# Altium project zb_relay.PrjPcb
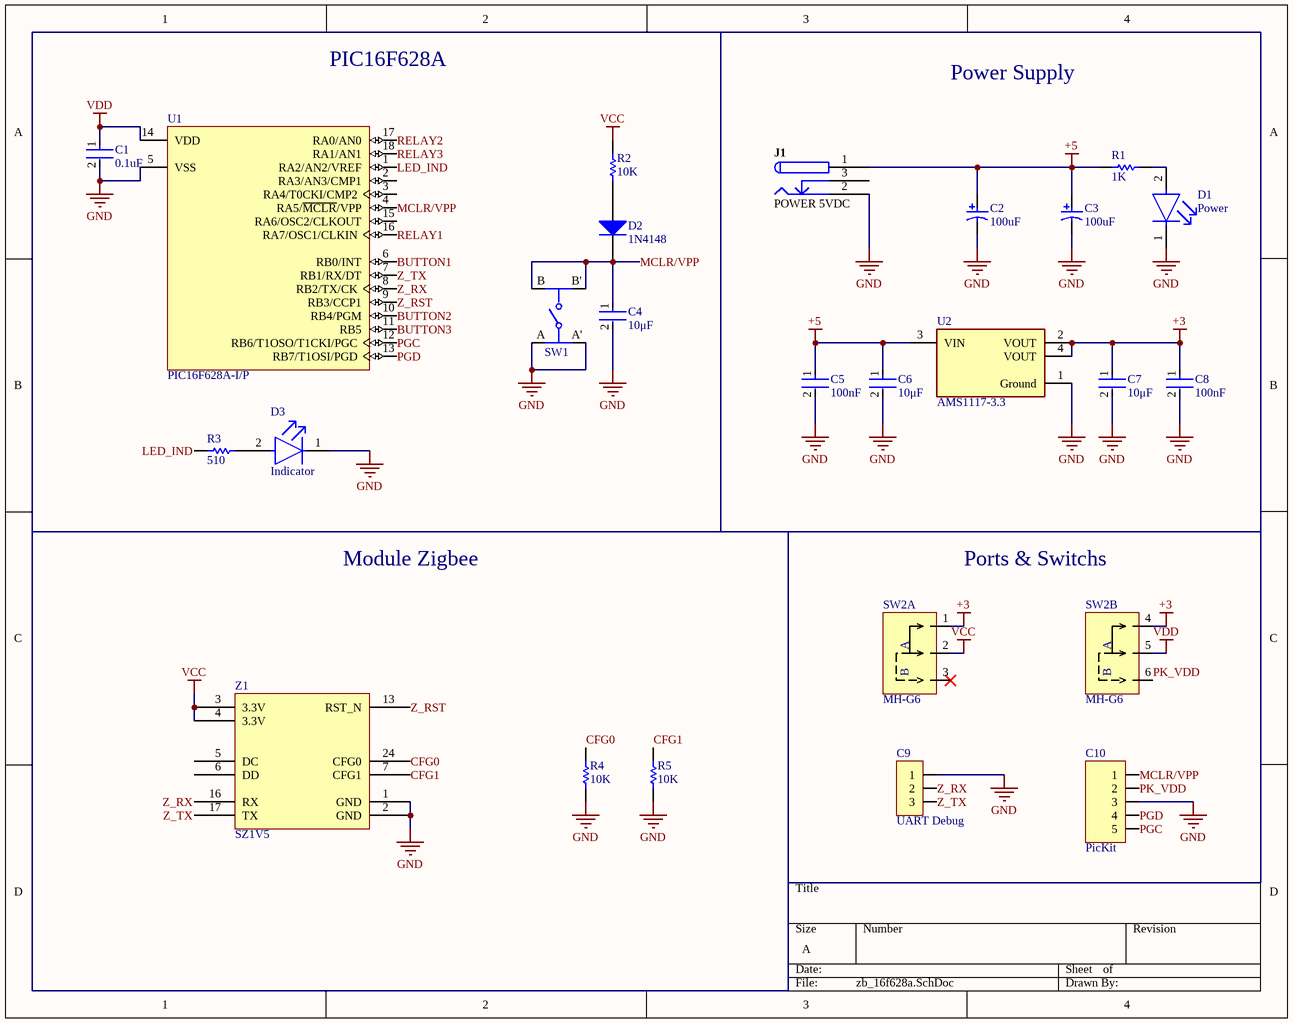
[diagram p0: zb_16f628a.SchDoc]
2 sheets, 57 parts. Net scope: global (net labels, ports and power ports of the same name join across sheets).
Board file: zb_relay.PcbDoc
Sheets:
  zb_16f628a.SchDoc
  relay_button.SchDoc

## Sheet zb_16f628a.SchDoc
size A; SheetNumber: 1; SheetTotal: 2

### Parts
C1  0.1uF  [FP-0603-L_1_6_0_15-W_0_81-MFG]
C2  100uF  [PNSC-FK-V-D8_V]
C3  100uF  [PNSC-FK-V-D8_V]
C4  10μF  [FP-0603-L_1_6_0_15-W_0_81-IPC_A]
C5  100nF  [FP-0603-L_1_6_0_15-W_0_81-IPC_A]
C6  10μF  [FP-0603-L_1_6_0_15-W_0_81-IPC_A]
C7  10μF  [FP-0603-L_1_6_0_15-W_0_81-IPC_A]
C8  100nF  [FP-0603-L_1_6_0_15-W_0_81-IPC_A]
C9  UART Debug  [JP3-D1C]
C10  PicKit  [JP5-D1C]
D1  Power  [FP-HLMP-4700-MFG]
D2  1N4148  [NXP-SOD27-2_V]
D3  Indicator  [FP-HLMP-4700-MFG]
J1  POWER 5VDC  [KYCN-KLDX-0202-B_V]
R1  1K  [RESC1609X55X30ML15T15]
R2  10K  [RESC1609X55X30ML15T15]
R3  510  [RESC1609X55X30ML15T15]
R4  10K  [RESC1609X55X30ML15T15]
R5  10K  [RESC1609X55X30ML15T15]
SW1  RESET  [FP-EVQ-PAG05R-MFG]  (value not drawn)
SW2  MH-G6  [MH-G6]  (parts A,B of 2)
U1  PIC16F628A-I/P  [PDIP300-P18]
U2  AMS1117-3.3  [FP-AMS1117-IPC_A]
Z1  SZ1V5  [SZ1V5 PINOUT MODULE]

### Nets
+3: C7.1 C8.1 SW2.1(A) SW2.4(A) U2.2(VOUT) U2.4(VOUT)
+5: C2.1 C3.1 C5.1 C6.1 J1.1 R1.2 U2.3(VIN)
GND: C1.2 C2.2 C3.2 C4.2 C5.2 C6.2 C7.2 C8.2 C9.1 C10.3 D1.1(C) D3.1(C) J1.2 R4.1 R5.1 SW1.A SW1.A' U1.5(VSS) U2.1(Ground) Z1.1(GND) Z1.2(GND)
VCC: R2.2 SW2.2(COM) Z1.3(3.3V) Z1.4(3.3V)
VDD: C1.1 SW2.5(COM) U1.14(VDD)
BUTTON1: U1.6(RB0/INT)
BUTTON2: U1.10(RB4/PGM)
BUTTON3: U1.11(RB5)
CFG0: R4.2 Z1.24(CFG0)
CFG1: R5.2 Z1.7(CFG1)
LED_IND: R3.2 U1.1(RA2/AN2/VREF)
MCLR/VPP: C4.1 C10.1 D2.2(K) SW1.B SW1.B' U1.4(RA5/~{MCLR}/VPP)
PGC: C10.5 U1.12(RB6/T1OSO/T1CKI/PGC)
PGD: C10.4 U1.13(RB7/T1OSI/PGD)
PK_VDD: C10.2 SW2.6(B)
RELAY1: U1.16(RA7/OSC1/CLKIN)
RELAY2: U1.17(RA0/AN0)
RELAY3: U1.18(RA1/AN1)
Z_RST: U1.9(RB3/CCP1) Z1.13(RST_N)
Z_RX: C9.2 U1.8(RB2/TX/CK) Z1.16(RX)
Z_TX: C9.3 U1.7(RB1/RX/DT) Z1.17(TX)
NetD1_2: D1.2(A) R1.1
NetD2_1: D2.1(A) R2.1
NetD3_2: D3.2(A) R3.1

Not connected (* = marked no-connect by the designer): J1 3; SW2 3(B)*; U1 2(RA3/AN3/CMP1) 3(RA4/T0CKI/CMP2) 15(RA6/OSC2/CLKOUT); Z1 5(DC) 6(DD)

### Notes on the sheet
- PIC16F628A
- Power Supply
- Module Zigbee
- Ports & Switchs

### Library data of the parts
C1 C4-C8 = CMP-1035-02592-4: General Purpose Ceramic Capacitor, 0603, 100nF, 10%, X7R, 15%, 50V; Dissipation Factor: 2.5%; Radiation Hardening: No; Termination: SMD/SMT; Tolerance: 10%; Lead Free: Lead Free; Width: 0.81mm; Max Operating Temperature: 125°C; Thickness: 0.035inch; Voltage Rating: 50V; Height: 0.9mm; Case/Package: 0603; Depth: 0.81mm; Number of Pins: 2; Capacitance: 100nF; REACH SVHC: No SVHC; Case Code (Imperial): 0603; Voltage: 50V; Voltage Rating (DC): 50V; Mount: Surface Mount; Length: 1.6mm; Min Operating Temperature: -55°C; Packaging: Tape and Reel; Case Code (Metric): 1608; Dielectric Material: Ceramic; Package Quantity: 1; Dielectric: X7R; Contact Plating: Tin
C2 C3 = CMP-2000-06206-1: Aluminum Electrolytic Capacitor, 100 uF, +/- 20%, 25 V, 2-Pin SMD (Size Code D8), -55 to 105 degC, RoHS, Tape and Reel; Manufacturer: Panasonic; Type: Can; Lifetime@Temperature: 2000Hrs@105°C; Capacitance: 100µF; Rated Voltage: 25V; Ripple Current: 280mA; Impedance: 0.34O; Case Size/Dimension: Ø6.3x7.7mm; Operating Temp-Max: 105°C; Series: FK; Package URL: http://industrial.panasonic.com/cdbs/www-data/pdf/RDE0000/DME0000COL48.pdf; Mounting Technology: SurfaceMount; Package Description: 2-Pin Electrolytic Aluminum Capacitor, Body 6.6 x 6.6 mm; Datasheet Version: 03/2016; Datasheet URL: http://industrial.panasonic.com/cdbs/www-data/pdf/RDE0000/ABA0000C1181.pdf; Manufacturer URL: http://www.panasonic.com/; Package Reference: FK-V-D8; Operating Temp Range: -55to+105°C
C9 = JP3: WR-PHD 2.54 mm Angled Socket Header; Manufacturer: W¨¹rth Elektronik eiSos GmbH; partNo: 613003143121; ComponentLink1 Description: Manufacturer; ComponentLink2 Description: Datasheet; NoPins: 03; Created Date: 29 March 2013; ComponentLink1URL: http://www.we-online.com; ComponentLink2URL: http://katalog.we-online.de/em/datasheet/6130xx143121.pdf; Created by: Karrer Zheng
C10 = JP5: WR-PHD 2.54 mm Angled Socket Header; Manufacturer: W¨¹rth Elektronik eiSos GmbH; partNo: 613005143121; ComponentLink1 Description: Manufacturer; ComponentLink2 Description: Datasheet; NoPins: 05; Created Date: 29 March 2013; ComponentLink1URL: http://www.we-online.com; ComponentLink2URL: http://katalog.we-online.de/em/datasheet/6130xx143121.pdf; Created by: Karrer Zheng
D1 D3 = CMP-18399-000008-1: LED RED DIFFUSED T-1 3/4 T/H; Manufacturer: Broadcom; Luminous Intensity: 2.3mcd; Peak Emmision Wavelength: 635nm; Forward Voltage: 1.7V; Viewing Angle: 50°; Led Orientation: Straight; Reverse Voltage: 5V; Forward Current: 2mA; Power Dissipation: 14mW; Wavelength: 626nm; Digikey Description: LED RED DIFFUSED T-1 3/4 T/H; Device Class L3: unset; Temperature Range Low: -40°C; Temperature Range High: +100°C; RoHS: TRUE; Package: HLMP-4700; Octopart: https://octopart.com/hlmp-4700-broadcom-71130526; Automotive: No; ComponentLink2URL: https://docs.broadcom.com/docs/AV02-1557EN; Colour: Red; Temperature: -40°C to +100°C; Lead Free: Yes; Category: Diode; ComponentLink2Description: Datasheet; Manufacturer Part Number: HLMP-4700; Device Class L1: Optoelectronics; Device Class L2: LEDs; Mouser Description: LED; Red; 2.3mcd; 0.24In.Dia.; T-1-3/4; 500mA; 1.7V; 635nm; 50deg; 5V; 24mW; -55degC;
D2 = CMP-0648-00002-1: High-speed Diode, 100 V, 450 mA, 2-Pin SOD27, RoHS; Manufacturer: NXP Semiconductors; Configuration: Single; IR (VR: 20 V)=25 nA; IFRM: 450 mA; IFSM: 4 A Max.; Trr: 4 ns Max.; Cd: 4 pF Max.; VR: 100 V Max.; VF (IF: 10 mA)=1 V; IF: 200 mA Max.; ComponentLink1Description: Manufacturer URL; RoHS: TRUE; ComponentLink1URL: http://www.nxp.com/; ComponentLink3Description: Package Specification; DatasheetVersion: Aug-04; ComponentLink2Description: Datasheet; PackageVersion: Aug-04; PackageReference: SOD27; ComponentLink3URL: http://www.nxp.com/documents/data_sheet/1N4148_1N4448.pdf; Mounting Technology: Through Hole; ComponentLink2URL: http://www.nxp.com/documents/data_sheet/1N4148_1N4448.pdf; PartNumber: 1N4148; PackageDescription: 2-Pin Hermetically Sealed Glass Package, Axial Leaded, Dia 1.85 mm, Body Length 4.25 mm, Lead Spread 25.4 mm
J1 = CMP-0256-00001-1: 3 Conductor Power Jack, 2 break 2 aux contacts; PartNumber: KLDX-0202-B; ComponentLink2URL: http://anacapa.kycon.com/Catalog_PDF/KLDX_0202.pdf; PackageReference: KLDX-0202-B; Contact Finish: Brass; ComponentLink2Description: Datasheet; Mounting Technology: Through Hole; PackageDescription: Jack, 9 x 14.5 mm Body, 2.5 mm Center Pin Diameter; ComponentLink1Description: Manufacturer URL; ComponentLink1URL: http://kycon.com/
R1-R5 = CMP-1012-00623-3: Chip Resistor, 10 KOhm, +/- 1%, 0.1 W, -55 to 155 degC, 0603 (1608 Metric), RoHS, Tape and Reel; Manufacturer: Panasonic; Voltage Rating: 75V; Case\/Package: 0603; Power Rating: 100mW; Resistance: 10KOhm; Temperature Coefficient: 100ppm\/degreesC; Number of Pins: 2; Package Reference: 603; Depth: 0.8mm; Mount: SurfaceMount; Package Description: 2-Pin Surface Mount Device, Body 1.6 x 0.85 mm; Datasheet Version: 02/2017; Length: 1.6mm; Lead Free: LeadFree; Height: 0.45mm; Number of Terminations: 2; Max Power Dissipation: 100mW; Min Operating Temperature: -55degC; Datasheet URL: https://industrial.panasonic.com/cdbs/www-data/pdf/RDA0000/AOA0000C304.pdf; Termination: SMD/SMT; Case Code (Metric): 1608; Case Code (Imperial): 0603; Tolerance: 1%; Max Operating Temperature: 155degC; RoHSCompliant: true; Voltage Rating (DC): 75V; Radiation Hardening: No; Packaging: TapeandReel; Composition: ThickFilm; Mounting Technology: SurfaceMount; Manufacturer URL: http://www.panasonic.com/; Width: 0.031inch; REACH SVHC: NoSVHC; Contact Plating: Tin; Military Standard: Not; Package Quantity: 1
SW1 = CMP-05618-000039-1: SWITCH TACTILE SPST-NO 0.02A 15V; Electrical Life: 50000Cycles; Actuator Color: Red; Switch Function: Off-Mom; Actuator Type: Standard; Max Current Rating: 20mA; Contact Resistance: 50mR; Operating Force: 2.6N; Switch Travel: 0.25mm; Illumination Type: Non-Illuminated; Throw Configuration: SPST; Actuator Length: 1.6mm; Max Operating Temperature: 70°C; Mount: Through Hole; RoHS Compliant: Yes; Depth: 6.5mm; Radiation Hardening: No; Orientation: Straight; Width: 6mm; REACH SVHC: No SVHC; Voltage Rating (DC): 15V; Package Quantity: 500; Size: 6mm; Max Voltage Rating (DC): 15V; Mechanical Life: 50000Cycles; Contact Current Rating: 20mA; Contact Plating: Silver; Lead Free: Lead Free; Series: EVQPA; Height: 5mm; Length: 6mm; Min Operating Temperature: -20°C; Current Rating: 20mA; Termination: PC Pin; Packaging: Bulk
SW2 = MH-G6: 6-pin switch MH-G6 2.54mm
U1 = CMP-0115-00122-1: FLASH-Based 8-Bit CMOS Microcontroller with nanoWatt Technology, 2K (x14-Bit words) FLASH, 224 Bytes SRAM, 18-Pin PDIP, 3.0 to 5.5V Supply Range, Industrial Temperature; DatasheetVersion: revF, Mar-2007; PackageReference: PDIP300-P18; PackageDescription: 18-Lead Plastic Dual In-Line (P) - 300 mil Body [PDIP]; PackageVersion: revBB, Aug-2009; Code_JEDEC: MS-001
U2 = CMP-209535-000001-1: LDO Voltage Regulators 1A, 3.3V; Manufacturer: Advanced Monolithic Systems; Dropout Voltage: 1.1V; Output Type: Fixed; Nominal Supply Current: 5mA; Max Power Dissipation: 1.2W; Max Supply Voltage: 15V; Number Of Outputs: 1; Standoff Height: 0.64mm; Max Junction Temp: +125°C; Height: 1.8mm; Package: AMS1117; Device Class L2: Power Management ICs; ComponentLink2Description: Datasheet; ComponentLink2URL: http://www.advanced-monolithic.com/pdf/ds1117.pdf; Category: IC; RoHS: TRUE; Automotive: No; Device Class L1: Integrated Circuits (ICs); Output Current: 1A; Device Class L3: Voltage Regulators - Linear; Temperature: -40°C to +125°C; Output Voltage: 3.3V; Manufacturer Part Number: AMS1117-3.3; Temperature Range Low: -40°C; Octopart: https://octopart.com/ams1117-3.3-advanced+monolithic+systems-25899300; Lead Free: Yes; Ipc Land Pattern Name: SOT229P700X180-4; Temperature Range High: +125°C
Z1 = SZ1V5_Alt

## Sheet relay_button.SchDoc
size A; SheetNumber: 2; SheetTotal: 2
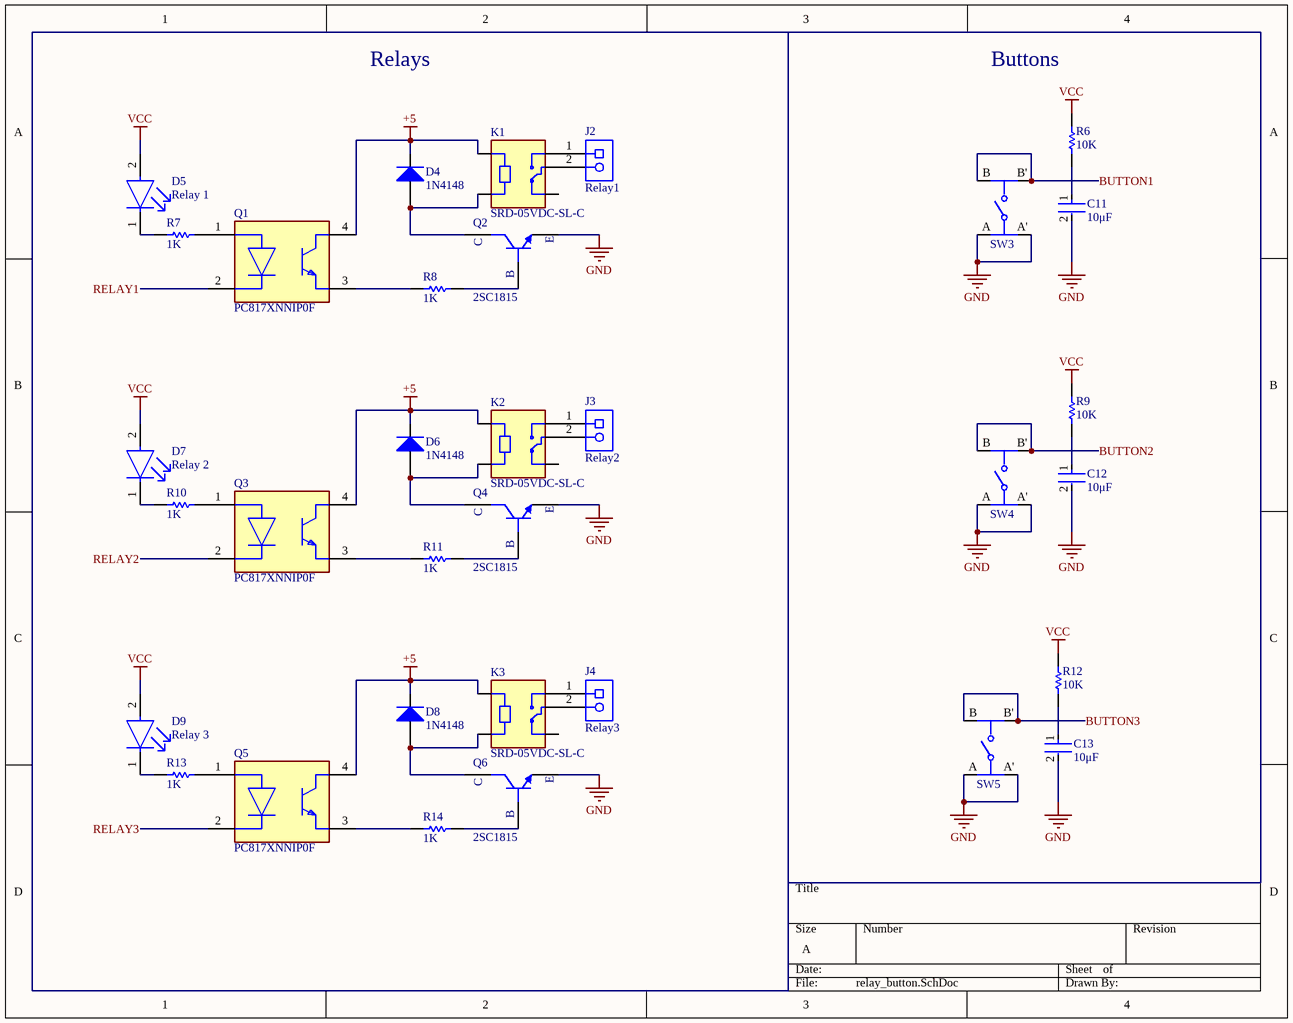
[diagram p1: relay_button.SchDoc]

### Parts
C11  10μF  [FP-0603-L_1_6_0_15-W_0_81-IPC_A]
C12  10μF  [FP-0603-L_1_6_0_15-W_0_81-IPC_A]
C13  10μF  [FP-0603-L_1_6_0_15-W_0_81-IPC_A]
D4  1N4148  [NXP-SOD27-2_V]
D5  Relay 1  [FP-HLMP-4700-MFG]
D6  1N4148  [NXP-SOD27-2_V]
D7  Relay 2  [FP-HLMP-4700-MFG]
D8  1N4148  [NXP-SOD27-2_V]
D9  Relay 3  [FP-HLMP-4700-MFG]
J2  Relay1  [PHOE-1729128-2_V]
J3  Relay2  [PHOE-1729128-2_V]
J4  Relay3  [PHOE-1729128-2_V]
K1  SRD-05VDC-SL-C  [RELAY_SRD-05VDC-SL-C]
K2  SRD-05VDC-SL-C  [RELAY_SRD-05VDC-SL-C]
K3  SRD-05VDC-SL-C  [RELAY_SRD-05VDC-SL-C]
Q1  PC817XNNIP0F  [FP-PC817XNNIP0F-MFG]
Q2  2SC1815  [SOT23_3]
Q3  PC817XNNIP0F  [FP-PC817XNNIP0F-MFG]
Q4  2SC1815  [SOT23_3]
Q5  PC817XNNIP0F  [FP-PC817XNNIP0F-MFG]
Q6  2SC1815  [SOT23_3]
R6  10K  [RESC1609X55X30ML15T15]
R7  1K  [RESC1609X55X30ML15T15]
R8  1K  [RESC1609X55X30ML15T15]
R9  10K  [RESC1609X55X30ML15T15]
R10  1K  [RESC1609X55X30ML15T15]
R11  1K  [RESC1609X55X30ML15T15]
R12  10K  [RESC1609X55X30ML15T15]
R13  1K  [RESC1609X55X30ML15T15]
R14  1K  [RESC1609X55X30ML15T15]
SW3  RESET  [FP-EVQ-PAG05R-MFG]  (value not drawn)
SW4  RESET  [FP-EVQ-PAG05R-MFG]  (value not drawn)
SW5  RESET  [FP-EVQ-PAG05R-MFG]  (value not drawn)

### Nets
+5: D4.2(K) D6.2(K) D8.2(K) K1.A1 K2.A1 K3.A1 Q1.4(C) Q3.4(C) Q5.4(C)
GND: C11.2 C12.2 C13.2 Q2.2(E) Q4.2(E) Q6.2(E) SW3.A SW3.A' SW4.A SW4.A' SW5.A SW5.A'
VCC: D5.2(A) D7.2(A) D9.2(A) R6.2 R9.2 R12.2
BUTTON1: SW3.B SW3.B'
BUTTON2: SW4.B SW4.B'
BUTTON3: SW5.B SW5.B'
RELAY1: Q1.2(C)
RELAY2: Q3.2(C)
RELAY3: Q5.2(C)
NetC11_1: C11.1 R6.1
NetC12_1: C12.1 R9.1
NetC13_1: C13.1 R12.1
NetD4_1: D4.1(A) K1.A2 Q2.3(C)
NetD5_1: D5.1(C) R7.1
NetD6_1: D6.1(A) K2.A2 Q4.3(C)
NetD7_1: D7.1(C) R10.1
NetD8_1: D8.1(A) K3.A2 Q6.3(C)
NetD9_1: D9.1(C) R13.1
NetJ2_1: J2.1 K1.NO
NetJ2_2: J2.2 K1.COM
NetJ3_1: J3.1 K2.NO
NetJ3_2: J3.2 K2.COM
NetJ4_1: J4.1 K3.NO
NetJ4_2: J4.2 K3.COM
NetQ1_1: Q1.1(A) R7.2
NetQ1_3: Q1.3(E) R8.1
NetQ2_1: Q2.1(B) R8.2
NetQ3_1: Q3.1(A) R10.2
NetQ3_3: Q3.3(E) R11.1
NetQ4_1: Q4.1(B) R11.2
NetQ5_1: Q5.1(A) R13.2
NetQ5_3: Q5.3(E) R14.1
NetQ6_1: Q6.1(B) R14.2

Not connected (* = marked no-connect by the designer): K1 NC; K2 NC; K3 NC

### Notes on the sheet
- Relays
- Buttons

### Library data of the parts
C11-C13 = CMP-1035-02592-4: as C1 on sheet zb_16f628a; Radiation Hardening: No; Termination: SMD/SMT; Tolerance: 10%; Lead Free: Lead Free; Width: 0.81mm; Max Operating Temperature: 125°C; Thickness: 0.035inch; Voltage Rating: 50V; Height: 0.9mm; Case/Package: 0603; Depth: 0.81mm; Number of Pins: 2; Capacitance: 100nF; REACH SVHC: No SVHC; Case Code (Imperial): 0603; Voltage: 50V; Voltage Rating (DC): 50V; Mount: Surface Mount; Length: 1.6mm; Min Operating Temperature: -55°C; Packaging: Tape and Reel; Case Code (Metric): 1608; Dielectric Material: Ceramic; Package Quantity: 1; Dielectric: X7R; Contact Plating: Tin
D4 D6 D8 = CMP-0648-00002-1: as D2 on sheet zb_16f628a; ComponentLink1Description: Manufacturer URL; RoHS: TRUE; ComponentLink1URL: http://www.nxp.com/; ComponentLink3Description: Package Specification; DatasheetVersion: Aug-04; ComponentLink2Description: Datasheet; PackageVersion: Aug-04; PackageReference: SOD27; ComponentLink3URL: http://www.nxp.com/documents/data_sheet/1N4148_1N4448.pdf; Mounting Technology: Through Hole; ComponentLink2URL: http://www.nxp.com/documents/data_sheet/1N4148_1N4448.pdf; PartNumber: 1N4148; PackageDescription: 2-Pin Hermetically Sealed Glass Package, Axial Leaded, Dia 1.85 mm, Body Length 4.25 mm, Lead Spread 25.4 mm
D5 D7 D9 = CMP-18399-000008-1: as D1 on sheet zb_16f628a; Digikey Description: LED RED DIFFUSED T-1 3/4 T/H; Device Class L3: unset; Temperature Range Low: -40°C; Temperature Range High: +100°C; RoHS: TRUE; Package: HLMP-4700; Octopart: https://octopart.com/hlmp-4700-broadcom-71130526; Automotive: No; ComponentLink2URL: https://docs.broadcom.com/docs/AV02-1557EN; Colour: Red; Temperature: -40°C to +100°C; Lead Free: Yes; Category: Diode; ComponentLink2Description: Datasheet; Manufacturer Part Number: HLMP-4700; Device Class L1: Optoelectronics; Device Class L2: LEDs; Mouser Description: LED; Red; 2.3mcd; 0.24In.Dia.; T-1-3/4; 500mA; 1.7V; 635nm; 50deg; 5V; 24mW; -55degC;
J2-J4 = CMP-2000-05815-1: PCB Terminal Block, 13.5 A, 400 V, 2-Pin THD, RoHS, Bulk; PartNumber: 1729128; Manufacturer: Phoenix Contact; Package Version: 03/2015; No. of Rows: 1; Pitch: 5.08mm; No. of Positions: 2; Voltage Rating: 400V; Current Rating: 13500mA; Manufacturer URL: http://www.phoenixcontact.com/; Datasheet URL: https://datasheet.ciiva.com/16046/1729128-16046181.pdf; RoHS: TRUE; Package URL: https://www.phoenixcontact.com/online/portal/pi/pxc/product_detail_page/!ut/p/b1/3VdJjqNKFDxLH8AFycySyWY2ozFsEPOMMQaDOX1XedGL_1Vdm5YXJleknhSKeBkvI6EA8ncAo3AYoDhBQGco6KN7VURTdemj9us_IEKEZo_YHiPAEWEFmDGOHMORkqKYCORBZxgL7ZoaZYcbFFUZ3fqxSY6GOuxydWUuHqz1ynmMFygu583Bob0Ewr6Sd_l-5m-kAueHiB0jpRwZwe58wwtkpxtMYd_LmGcDRU02dRNEyWt6Y2ti5pSyJ_reIkzIulrqApdnbT11V5jnCKbYNCvhEM1MCpPByat_X379-iThf08CI5GfOPqfBeS3BRoBOdD55AKVv0iLwCMq-2BrzXWSGRH7pUGD9uwXQjiph3xL0DKQwdGa0JImiIOmBNOestqgwTHSSs2oOep-78apyXQBvNi8ZLaFjvjWvcaUEBu0MC6Wbe-d6mB0FAebo2lUWinqYaZs5DAYzV0RP9yitUjnGJ0iI9xhZkT42OCQNUJJhkgWINNQLP2JFP6OpMg3JCVg70jqHT0lvKOnhHf0lPuOnnLf0VPuWx6_dxwUIvwk5WMkT0kLL1mh61l2yZVSzG3pYV_bqo-mj6uMKwKwdnnW8Jh5RTOJzMOA5c-eJDaZQw4mTMPH02PvS_ZAqNVjVTo2WyYLkwH_KU1mmmG5kjRhDqPXLwwVHvVOjCM60-fpXvTDfMGW1PVFVS1r4e4yVDk4ZdNbkUHvqPqQSeian4UD39fNKmachqdJ1NJbyk8rXT9mXTvPk3oE5meulKGgiruPJek-4I9hTT6G8ZLOyRSm2RRVbThERQad5OS28hdt4YW4vG0stgYYzsWsK4_7y6DZMjJSCqri1kyiZR5vD7pwIrNR7QwPHTcLTI5qT7eRlpHrdGiupYlqQDJ7zy_CND8fWWBoLRXxk1RVcXiBQwbTD4Xi7KL-FuO94t9xaqweXzH; Package Description: 2-Pin Through Hole Device, Body 8.1 x 10.16 mm, Pitch 5.08 mm; Datasheet Version: 12/2013; Mounting Technology: ThroughHole; Orientation: Horizontal; Package Reference: 1729128-2; Packing: Bulk
K1-K3 = SRD-05VDC-SL-C: 5V Trigger Relay Module For Arduino And Raspberry Pi 5V Trigger Relay Module For Arduino And Raspberry Pi; MF: {'manufacturer': u'Songle Relay'}; Availability: Unavailable; Value: *; Package: None; Price: None; MP: SRD-05VDC-SL-C
Q1 Q3 Q5 = CMP-65434-000005-1: OPTOISOLATOR 5KV TRANS 4SMD; Reverse Breakdown Voltage: 6V; Output Current per Channel: 30mA; Power Dissipation: 200mW; Collector-emitter Voltage-Max: 200mV; Max Output Voltage: 80V; Input Current: 50mA; Forward Voltage: 1.4V; Fall Time: 18000ns; Number of Elements: 1; Input Type: DC; Packaging: Tape and Reel; RoHS Compliant: Yes; Contact Plating: Copper; Min Operating Temperature: -30°C; Collector Emitter Saturation Voltage: 200mV; Max Input Current: 50mA; Radiation Hardening: No; Max Collector Current: 50mA; Case/Package: SMD/SMT; Mount: Surface Mount; Output Voltage: 80V; Forward Current: 50mA; Max Power Dissipation: 200mW; Collector Emitter Voltage (VCEO): 80V; Number of Channels: 1; Rise Time: 18000ns; Isolation Voltage: 5kV; Number of Pins: 4; Lead Free: Lead Free; Package Quantity: 2000; Isolation Voltage-Max: 5kV; Max Operating Temperature: 100°C
Q2 Q4 Q6 = 2SC1815: TRANS NPN 50V 0.15A SOT23-3; Solder: SMT; MPN: 2SC1815; Value: 2SC1815
R6-R14 = CMP-1012-00623-3: as R1 on sheet zb_16f628a; Number of Pins: 2; Package Reference: 603; Depth: 0.8mm; Mount: SurfaceMount; Package Description: 2-Pin Surface Mount Device, Body 1.6 x 0.85 mm; Datasheet Version: 02/2017; Length: 1.6mm; Lead Free: LeadFree; Height: 0.45mm; Number of Terminations: 2; Max Power Dissipation: 100mW; Min Operating Temperature: -55degC; Datasheet URL: https://industrial.panasonic.com/cdbs/www-data/pdf/RDA0000/AOA0000C304.pdf; Termination: SMD/SMT; Case Code (Metric): 1608; Case Code (Imperial): 0603; Tolerance: 1%; Max Operating Temperature: 155degC; RoHSCompliant: true; Voltage Rating (DC): 75V; Radiation Hardening: No; Packaging: TapeandReel; Composition: ThickFilm; Mounting Technology: SurfaceMount; Manufacturer URL: http://www.panasonic.com/; Width: 0.031inch; REACH SVHC: NoSVHC; Contact Plating: Tin; Military Standard: Not; Package Quantity: 1
SW3-SW5 = CMP-05618-000039-1: as SW1 on sheet zb_16f628a; Max Operating Temperature: 70°C; Mount: Through Hole; RoHS Compliant: Yes; Depth: 6.5mm; Radiation Hardening: No; Orientation: Straight; Width: 6mm; REACH SVHC: No SVHC; Voltage Rating (DC): 15V; Package Quantity: 500; Size: 6mm; Max Voltage Rating (DC): 15V; Mechanical Life: 50000Cycles; Contact Current Rating: 20mA; Contact Plating: Silver; Lead Free: Lead Free; Series: EVQPA; Height: 5mm; Length: 6mm; Min Operating Temperature: -20°C; Current Rating: 20mA; Termination: PC Pin; Packaging: Bulk

## Nets that join several sheets
+5: zb_16f628a (7 pins), relay_button (9 pins)
GND: zb_16f628a (21 pins), relay_button (12 pins)
VCC: zb_16f628a (R2.2 SW2.2 Z1.3 Z1.4), relay_button (6 pins)
BUTTON1: zb_16f628a (U1.6), relay_button (SW3.B SW3.B')
BUTTON2: zb_16f628a (U1.10), relay_button (SW4.B SW4.B')
BUTTON3: zb_16f628a (U1.11), relay_button (SW5.B SW5.B')
RELAY1: zb_16f628a (U1.16), relay_button (Q1.2)
RELAY2: zb_16f628a (U1.17), relay_button (Q3.2)
RELAY3: zb_16f628a (U1.18), relay_button (Q5.2)